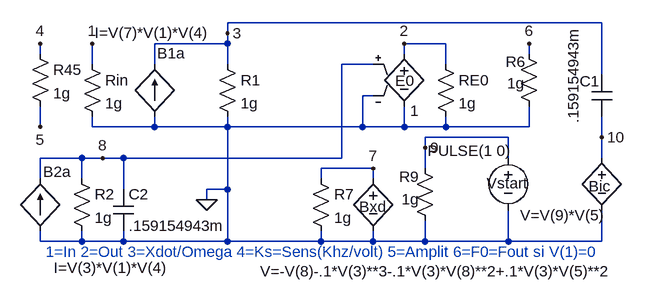
[diagram p0: schematic vcoprog.asc]
vcoprog.asc, the LTspice schematic file:
Version 4
SHEET 1 1184 680
WIRE -240 208 -240 192
WIRE -240 320 -240 288
WIRE -240 400 -240 368
WIRE -240 496 -240 480
WIRE -176 368 -240 368
WIRE -176 400 -176 368
WIRE -176 496 -240 496
WIRE -176 496 -176 480
WIRE -160 224 -160 192
WIRE -160 320 -160 304
WIRE -144 368 -176 368
WIRE -112 368 -144 368
WIRE -112 416 -112 368
WIRE -112 496 -176 496
WIRE -112 496 -112 480
WIRE -64 224 -64 192
WIRE -64 320 -160 320
WIRE -64 320 -64 304
WIRE 16 432 16 416
WIRE 48 176 48 160
WIRE 48 192 -64 192
WIRE 48 192 48 176
WIRE 48 224 48 192
WIRE 48 320 -64 320
WIRE 48 320 48 304
WIRE 48 416 16 416
WIRE 48 416 48 320
WIRE 48 496 -112 496
WIRE 48 496 48 416
WIRE 192 400 192 384
WIRE 192 496 48 496
WIRE 192 496 192 480
WIRE 224 368 -112 368
WIRE 224 368 224 224
WIRE 256 320 48 320
WIRE 256 320 256 272
WIRE 272 224 224 224
WIRE 272 272 256 272
WIRE 272 384 192 384
WIRE 272 400 272 384
WIRE 272 496 192 496
WIRE 272 496 272 480
WIRE 320 208 320 192
WIRE 320 320 256 320
WIRE 320 320 320 288
WIRE 352 352 352 336
WIRE 352 384 352 352
WIRE 352 496 272 496
WIRE 352 496 352 464
WIRE 384 192 320 192
WIRE 384 224 384 192
WIRE 384 320 320 320
WIRE 384 320 384 304
WIRE 480 336 352 336
WIRE 480 368 480 336
WIRE 480 496 352 496
WIRE 480 496 480 448
WIRE 512 208 512 192
WIRE 512 320 384 320
WIRE 512 320 512 288
WIRE 624 160 48 160
WIRE 624 240 624 160
WIRE 624 336 624 304
WIRE 624 368 624 336
WIRE 624 496 480 496
WIRE 624 496 624 448
FLAG 16 432 0
FLAG -160 192 1
FLAG 48 176 3
FLAG -144 368 8
FLAG 272 384 7
FLAG 320 192 2
FLAG 352 352 9
FLAG 624 336 10
FLAG -240 192 4
FLAG -240 320 5
FLAG 512 192 6
SYMBOL res -176 208 R0
SYMATTR InstName Rin
SYMATTR Value 1g
SYMBOL res 368 208 R0
SYMATTR InstName RE0
SYMATTR Value 1g
SYMBOL bi -64 304 R180
WINDOW 0 -47 97 Left 0
WINDOW 3 -84 129 Left 0
SYMATTR InstName B1a
SYMATTR Value I=V(7)*V(1)*V(4)
SYMBOL res 32 208 R0
SYMATTR InstName R1
SYMATTR Value 1g
SYMBOL bi -240 480 R180
WINDOW 0 -47 91 Left 0
WINDOW 3 -197 -57 Left 0
SYMATTR InstName B2a
SYMATTR Value I=V(3)*V(1)*V(4)
SYMBOL res -192 384 R0
SYMATTR InstName R2
SYMATTR Value 1g
SYMBOL cap -128 416 R0
SYMATTR InstName C2
SYMATTR Value .159154943m
SYMBOL bv 272 384 R0
WINDOW 0 -21 59 Left 0
WINDOW 3 -174 158 Left 0
SYMATTR InstName Bxd
SYMATTR Value V=-V(8)-.1*V(3)**3-.1*V(3)*V(8)**2+.1*V(3)*V(5)**2
SYMBOL res 176 384 R0
SYMATTR InstName R7
SYMATTR Value 1g
SYMBOL e 320 192 R0
WINDOW 0 -14 57 Left 0
WINDOW 3 9 103 Left 0
SYMATTR InstName E0
SYMATTR Value 1
SYMBOL voltage 480 352 R0
WINDOW 0 -33 55 Left 0
WINDOW 3 -124 5 Left 0
WINDOW 123 0 0 Left 0
WINDOW 39 0 0 Left 0
SYMATTR InstName Vstart
SYMATTR Value PULSE(1 0)
SYMBOL res 336 368 R0
WINDOW 0 -24 29 Left 0
WINDOW 3 -20 63 Left 0
SYMATTR InstName R9
SYMATTR Value 1g
SYMBOL bv 624 352 R0
WINDOW 0 -20 59 Left 0
WINDOW 3 -126 104 Left 0
SYMATTR InstName Bic
SYMATTR Value V=V(9)*V(5)
SYMBOL cap 608 240 R0
WINDOW 0 -18 10 Left 0
WINDOW 3 -28 -74 VRight 0
SYMATTR InstName C1
SYMATTR Value .159154943m
SYMBOL res -256 192 R0
SYMATTR InstName R45
SYMATTR Value 1g
SYMBOL res 496 192 R0
WINDOW 0 -20 28 Left 0
WINDOW 3 -18 61 Left 0
SYMATTR InstName R6
SYMATTR Value 1g
TEXT -232 512 Left 0 ;1=In 2=Out 3=Xdot/Omega 4=Ks=Sens(Khz/volt) 5=Amplit 6=F0=Fout si V(1)=0

The netlist it stands for:
* vcoprog.asc
Rin 1 0 1g
RE0 2 0 1g
B1a 0 3 I=V(7)*V(1)*V(4)
R1 3 0 1g
B2a 0 8 I=V(3)*V(1)*V(4)
R2 8 0 1g
C2 8 0 .159154943m
Bxd 7 0 V=-V(8)-.1*V(3)**3-.1*V(3)*V(8)**2+.1*V(3)*V(5)**2
R7 7 0 1g
E0 2 0 8 0 1
Vstart 9 0 PULSE(1 0)
R9 9 0 1g
Bic 10 0 V=V(9)*V(5)
C1 3 10 .159154943m
R45 4 5 1g
R6 6 0 1g
* 1=In 2=Out 3=Xdot/Omega 4=Ks=Sens(Khz/volt) 5=Amplit 6=F0=Fout si V(1)=0
.backanno
.end